# Altium schematic sheet RP_ComputeModule3_rev.3.0_HDMi.SchDoc
size A4 portrait
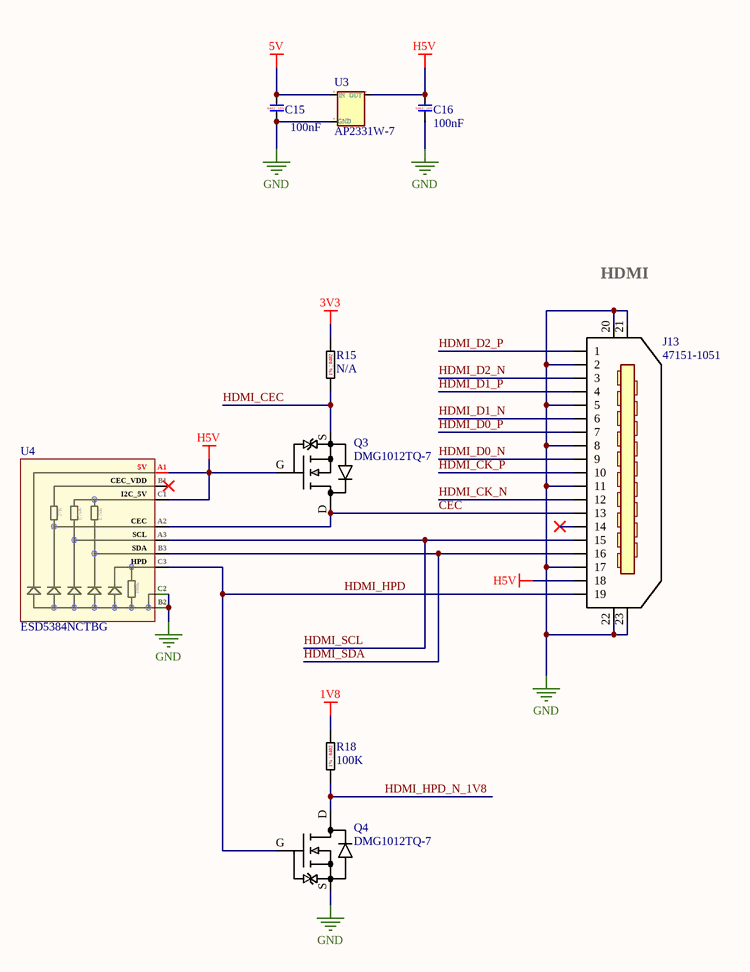
[diagram p0: RP_ComputeModule3_rev.3.0_HDMi.SchDoc]

## Parts
C15  100nF  [GJM 0402 C]
C16  100nF  [GJM 0402 C]
J13  47151-1051  [Molex 471511051 HDMi]
Q3  DMG1012TQ-7  [Diodes SOT523]
Q4  DMG1012TQ-7  [Diodes SOT523]
R15  N/A  [RES0402N/A]  (no BOM)
R18  100K  [RES0402]
U3  AP2331W-7  [DiodesInc SC59-BEC]
U4  ESD5384NCTBG  [ONSemi CSP-9]

## Nets
1V8: R18.1
3V3: R15.1
5V: C15.2 U3.IN
GND: C15.1 C16.1 J13.2 J13.5 J13.8 J13.11 J13.17 J13.20 J13.21 J13.22 J13.23 Q4.S U3.GND U4.B2 U4.C2
H5V: C16.2 J13.18 Q3.G U3.OUT U4.A1 U4.C1
CEC: J13.13 Q3.D U4.A2
HDMI_CEC: Q3.S R15.2
HDMI_CK_N: J13.12
HDMI_CK_P: J13.10
HDMI_D0_N: J13.9
HDMI_D0_P: J13.7
HDMI_D1_N: J13.6
HDMI_D1_P: J13.4
HDMI_D2_N: J13.3
HDMI_D2_P: J13.1
HDMI_HPD: J13.19 Q4.G U4.C3
HDMI_HPD_N_1V8: Q4.D R18.2
HDMI_SCL: J13.15 U4.A3
HDMI_SDA: J13.16 U4.B3

Not connected (* = marked no-connect by the designer): J13 14*; U4 B1*

## Notes on the sheet
- HDMI
- (in symbol ESD5384NCTBG) 5V; CEC_VDD; I2C_5V; 27K; 1.75K; CEC; SCL; SDA; HPD; 100K
- (in symbol GRM155R71A104JA01D) 0402 | 10V
- (in symbol Resistor_N/A) 1% | 0402
- (in symbol SG73P1ETTP1003F) 1% | 0402

## Library data of the parts
C15 C16 = GRM155R71A104JA01D: Multilayer Ceramic Capacitors MLCC - SMD/SMT 0402 0.1uF 10volts 5%; Manufacturer: Murata Electronics; Type: Chip Monolithic Ceramic Capacitor; Voltage Rating DC: 10 VDC; Capacitance - pF: 100000 pF; Dielectric: X7R; Supplier 1: Mouser; Manufacturer Part Number: GRM155R71A104JA01D; RoHS: RoHS Compliant; Category: Multilayer Ceramic Capacitors MLCC - SMD/SMT; Stock 1: 376; Pricing 1: 1=0.100, 10=0.024, 100=0.011, 500=0.008, 1000=0.006, 5000=0.005, 10000=0.004 (USD); Capacitance: 0.1 uF; Height: 0.5 mm; Length: 1 mm; Package / Case: 0402 (1005 metric); Packaging: Cut Tape; Product: General Type MLCCs; Series: GRM; Termination Style: SMD/SMT; Tolerance: 5 %; Width: 0.5 mm; Brand: Murata Electronics; Capacitance - nF: 100 nF; Case Code - in: 0402; Case Code - mm: 1005; Maximum Operating Temperature: + 125 C; Minimum Operating Temperature: - 55 C; Standard Pack Qty: 10000; RoHS - Mouser: Y; Minimum Order Quantity: 1; Reeling: True; ComponentLink1URL: https://www.mouser.com/ds/2/281/c02e-2905.pdf; ComponentLink1Description: https://www.mouser.com/ds/2/281/c02e-2905.pdf
J13 = 47151-1051: HDMI, Displayport & DVI Connectors 1.0 HDMI RIGHT ANGLE NGLE HEADER ASSEMBLY; Manufacturer: Molex; Body Material: Thermoplastic; Gender: Female; Voltage Rating (DC): 40V; Number of Positions: 19; Current Rating: 500mA; Supplier 1: Mouser; Manufacturer Part Number: 47151-1051; Stock 1: 773; Pricing 1: 1=1.48, 10=1.39, 50=1.27, 100=1.15, 1000=0.904, 10000=0.802 (USD); Contact Plating: Gold; Contact Material: Copper Alloy; Colour: Black; Package Quantity: 1050; Packaging: Tape and Reel; Termination: SMD/SMT; Orientation: Right Angle; Number of Rows: 2; Number of Circuits: 19; REACH SVHC: No SVHC; Halogen Free: Low Halogen; ComponentLink1URL: https://datasheet.ciiva.com/5053/0471511051-io-connectors-170027-5053366.pdf; ComponentLink1Description: https://datasheet.ciiva.com/5053/0471511051-io-connectors-170027-5053366.pdf
Q3 Q4 = DMG1012TQ-7: MOSFET NCH 20V 630MA SOT523; Manufacturer: Diodes; Rds On Max: 400mR; Input Capacitance: 60.67pF; Max Power Dissipation: 280mW; Supplier 1: Mouser; Manufacturer Part Number: DMG1012TQ-7; Stock 1: 11314; Pricing 1: 1=0.34, 10=0.225, 50=0.225, 100=0.094, 1000=0.064, 10000=0.043 (USD); Mount: Surface Mount; Case/Package: SOT-523; Number of Pins: 3; Min Operating Temperature: -55°C; Max Operating Temperature: 150°C; Packaging: Tape and Reel; Drain to Source Voltage (Vdss): 20V; Continuous Drain Current (ID): 630mA; ComponentLink1URL: http://www.mouser.com/ds/2/115/ds31783-892575.pdf; ComponentLink1Description: http://www.mouser.com/ds/2/115/ds31783-892575.pdf; ComponentLink2URL: https://www.diodes.com/assets/Datasheets/ds31783.pdf; ComponentLink2Description: https://www.diodes.com/assets/Datasheets/ds31783.pdf
R15 = Resistor_N/A
R18 = SG73P1ETTP1003F: Thick Film Resistors - SMD 0.125W 100Kohm 1% 200ppm; Manufacturer: KOA Speer; Resistance: 100kR; Power Rating: 125mW; Voltage Rating: 200V; Temperature Coefficient: 200ppm/°C; Voltage Rating (DC): 50V; Supplier 1: Mouser; Manufacturer Part Number: SG73P1ETTP1003F; Stock 1: 17094; Pricing 1: 1=0.24, 10=0.24, 50=0.053, 100=0.041, 1000=0.03, 10000=0.018 (USD); Case/Package: 0402; Case Code (Imperial): 0402; Case Code (Metric): 1005; Min Operating Temperature: -55°C; Max Operating Temperature: 155°C; Tolerance: 1%; Packaging: Tape and Reel; Termination: SMD/SMT; ComponentLink1URL: https://datasheet.ciiva.com/5567/sg73-5567782.pdf; ComponentLink1Description: https://datasheet.ciiva.com/5567/sg73-5567782.pdf
U3 = AP2331W-7: LOAD SWITCH SC59; Manufacturer: Diodes; Number of Outputs: 1; Output Current: 200mA; Max Supply Voltage: 5.2V; Min Supply Voltage: 2.7V; Interface: On/Off; On-State Resistance: 350mR; Turn-On Delay Time: 700us; Fault Protection: Over Temperature,Reverse Current; Supplier 1: Mouser; Manufacturer Part Number: AP2331W-7; Stock 1: 6726; Pricing 1: 1=0.51, 10=0.388, 50=0.388, 100=0.21, 1000=0.158, 10000=0.127 (USD); Mount: Surface Mount; Case/Package: TO-236-3; Number of Pins: 59; Min Operating Temperature: -40°C; Max Operating Temperature: 85°C; Package Quantity: 3000; Packaging: Tape and Reel; Max Output Current: 200mA; Voltage: 5.2V; Current: 200mA; Length: 3.1mm; Height: 1.3mm; Width: 1.7mm; Radiation Hardening: No; REACH SVHC: No SVHC; ComponentLink1URL: https://datasheet.ciiva.com/18567/ap2331-18567928.pdf; ComponentLink1Description: https://datasheet.ciiva.com/18567/ap2331-18567928.pdf; ComponentLink2URL: https://datasheet.ciiva.com/18567/ap2331-18567929.pdf; ComponentLink2Description: https://datasheet.ciiva.com/18567/ap2331-18567929.pdf; ComponentLink3URL: https://datasheet.ciiva.com/18567/ap2331-18567930.pdf; ComponentLink3Description: https://datasheet.ciiva.com/18567/ap2331-18567930.pdf
U4 = ESD5384NCTBG: TVS DIODE 3VWM 9WLCSP; Manufacturer: ON Semiconductor; Capacitance: 29pF; Direction: Unidirectional; Number of Unidirectional Channels: 5; Reverse Standoff Voltage: 3V; Min Breakdown Voltage: 6V; Power Line Protection: No; ESD Protection: Yes; Max Reverse Leakage Current: 200nA; Supplier 1: Mouser; Manufacturer Part Number: ESD5384NCTBG; Stock 1: 9540; Pricing 1: 1=0.44, 10=0.362, 50=0.362, 100=0.221, 1000=0.171, 10000=0.136 (USD); Number of Pins: 9; Min Operating Temperature: -30°C; Max Operating Temperature: 85°C; Package Quantity: 5000; Packaging: Tape and Reel; Number of Lines: 5; Length: 1.14mm; Height: 0.63mm; Width: 1.14mm; Depth: 1.14mm; Radiation Hardening: No; Lead Free: Lead Free; Halogen Free: Halogen Free; ComponentLink1URL: https://datasheet.ciiva.com/11195/esd5384-d-11195286.pdf; ComponentLink1Description: https://datasheet.ciiva.com/11195/esd5384-d-11195286.pdf; ComponentLink2URL: https://datasheet.ciiva.com/12545/esd5384-d-119513-12545067.pdf; ComponentLink2Description: https://datasheet.ciiva.com/12545/esd5384-d-119513-12545067.pdf; ComponentLink3URL: https://datasheet.ciiva.com/354/esd5384-d-354168.pdf; ComponentLink3Description: https://datasheet.ciiva.com/354/esd5384-d-354168.pdf